# Altium schematic sheet ModuleAmp.SchDoc
size A; SheetNumber: 1; SheetTotal: 1
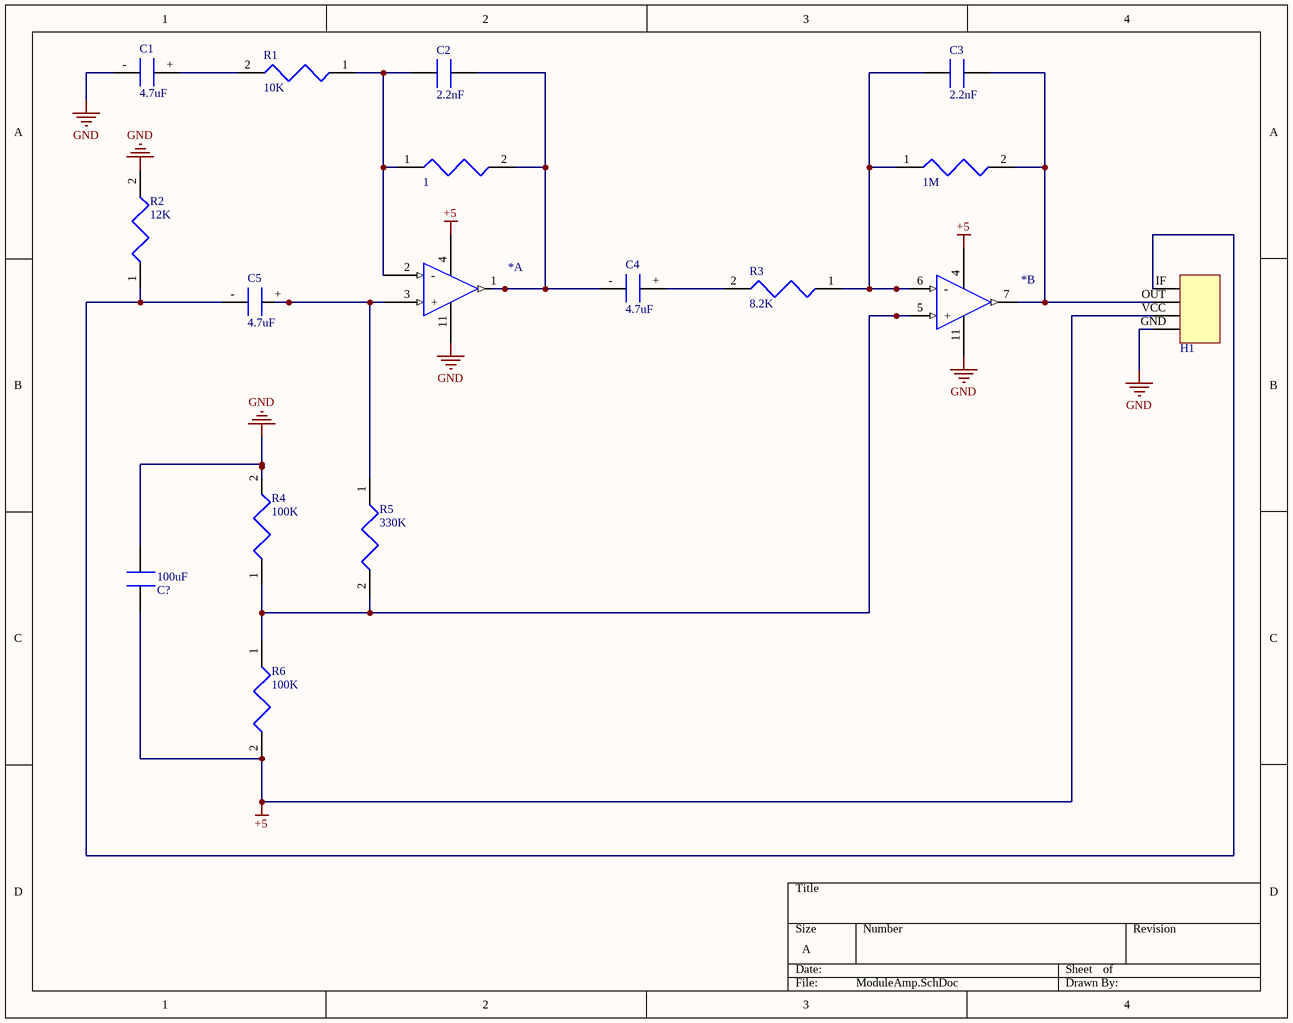
[diagram p0: ModuleAmp.SchDoc]

## Parts
(Parts that share a designator on the sheet are numbered #1, #2 ... from top to bottom, then left to right.)
1  R?  [R1M]  (value not drawn)
1M  R?  [R1M]  (value not drawn)
100uF  C?  [100uF]
*#1  LM324N  (value not drawn)  (part A of 4)
*#2  LM324N  (value not drawn)  (part B of 4)
C1  4.7uF  [4.7uF Polarised]
C2  2.2nF  [2.2nF]
C3  2.2nF  [2.2nF]
C4  4.7uF  [4.7uF Polarised]
C5  4.7uF  [4.7uF Polarised]
H1  Header  [4x1 Male]  (value not drawn)
R1  10K  [R10k]
R2  12K  [R12K]
R3  8.2K  [R8.2k]
R4  100K  [R100k]
R5  330K  [R330k]
R6  100K  [R100k]

## Nets
+5: 100uF.72 *#1.4(VCC) *#2.4(VCC) H1.VCC R6.2
GND: 100uF.71 *#1.11(GND) *#2.11(GND) C1.- H1.GND R2.2 R4.2
Net1_1: 1.1 *#1.2(-) C2.68 R1.1
Net1_2: 1.2 *#1.1(Out) C2.67 C4.-
Net1M_1: 1M.1 *#2.6(-) C3.70 R3.1
Net1M_2: 1M.2 *#2.7(Out) C3.69 H1.OUT
Net*#1_3: *#1.3(+) C5.+ R5.1
Net*#2_5: *#2.5(+) R4.1 R5.2 R6.1
NetC1_+: C1.+ R1.2
NetC4_+: C4.+ R3.2
NetC5_-: C5.- H1.IF R2.1

## Library data of the parts
1 1M = RNV14FAL1M00: Res Metal Film 1MegaOhm 1% 1/4W ±100ppm/°C Conformal Axial Box; Manufacturer: Stackpole Electronics; Resistance: 1MR; Max Power Dissipation: 250mW; Temperature Coefficient: 200ppm/°C; Supplier 1: Digikey; Supplier Part Number 1: RNV14FAL1M00CT-ND; Manufacturer Part Number: RNV14FAL1M00; RoHS: Yes; Category: Through-Hole Resistors; Stock 1: 115801; Pricing 1: 1=0.24, 10=0.19, 25=0.1456, 50=0.1054, 100=0.0742, 250=0.06, 500=0.04726, 1000=0.03272 (USD); Mount: Through Hole,Axial; Case/Package: Axial; Min Operating Temperature: -55°C; Max Operating Temperature: 155°C; Tolerance: 1%; Packaging: Cut Tape; Number of Terminations: 2; Features: Moisture Resistant,Flame Retardant Coating; Series: RNV; RoHS Compliant: Yes; ComponentLink1URL: https://www.seielect.com/Catalog/SEI-RNV.pdf?src-supplier=Digikey; ComponentLink1Description: https://www.seielect.com/Catalog/SEI-RNV.pdf?src-supplier=Digikey
100uF = ESK107M025AE3EA: Radial Can ALUMINUM ELECTROLYTIC CAPACITOR ESK 25V 100muF ±20% 0.248Dia 6.30mm; Manufacturer: KEMET; Supplier 1: Digikey; Supplier Part Number 1: 399-6650-1-ND; Manufacturer Part Number: ESK107M025AE3EA; RoHS: Yes; Category: Aluminum Electrolytic Capacitors; Stock 1: 196242; Pricing 1: 1=0.24, 10=0.157, 50=0.099, 100=0.0793, 500=0.05724, 1000=0.05064 (USD); ComponentLink1URL: https://datasheet.ciiva.com/5336/datasheetpn-esk107m025ae3ea-5336461.pdf?src-supplier=Mouser; ComponentLink1Description: https://datasheet.ciiva.com/5336/datasheetpn-esk107m025ae3ea-5336461.pdf?src-supplier=Mouser
*#1 *#2 = LM324N: Operational Amplifier, Quad, 1 Mhz, 4, 0.5 V/ S, 1.5V To 16V, Dip, 14 Rohs Compliant: Yes; Manufacturer: Texas Instruments; Supplier 1: Digikey; Supplier Part Number 1: 296-1391-5-ND; Manufacturer Part Number: LM324N; RoHS: No; Category: Amplifiers - Op Amps, Buffer, Instrumentation; Stock 1: 30137; Pricing 1: 1=0.44, 10=0.375, 25=0.35, 100=0.28, 250=0.25996, 500=0.21998, 1000=0.16998, 2500=0.15498, 5000=0.14499 (USD); ComponentLink1URL: https://datasheet.ciiva.com/5997/1768103-5997424.pdf?src-supplier=Farnell; ComponentLink1Description: https://datasheet.ciiva.com/5997/1768103-5997424.pdf?src-supplier=Farnell; ComponentLink2URL: https://datasheet.ciiva.com/1796/lm224-1796723.pdf?src-supplier=Digikey; ComponentLink2Description: https://datasheet.ciiva.com/1796/lm224-1796723.pdf?src-supplier=Digikey; ComponentLink3URL: https://datasheet.ciiva.com/7148/lm224-7148869.pdf?src-supplier=Newark; ComponentLink3Description: https://datasheet.ciiva.com/7148/lm224-7148869.pdf?src-supplier=Newark; ComponentLink4URL: https://datasheet.ciiva.com/8008/1905671-8008853.pdf?src-supplier=Element14; ComponentLink4Description: https://datasheet.ciiva.com/8008/1905671-8008853.pdf?src-supplier=Element14; ComponentLink5URL: https://datasheet.ciiva.com/7709/1840878-7709815.pdf?src-supplier=Element14; ComponentLink5Description: https://datasheet.ciiva.com/7709/1840878-7709815.pdf?src-supplier=Element14; ComponentLink6URL: https://datasheet.ciiva.com/7709/1840878-7709816.pdf?src-supplier=Element14; ComponentLink6Description: https://datasheet.ciiva.com/7709/1840878-7709816.pdf?src-supplier=Element14
C1 C4 C5 = ECA-2EM4R7B: Cap Aluminum 4.7uF 250V 20% (8 X 11.5mm) Radial 5mm 86mA 2000 hr 85°C Ammo Pack; Manufacturer: Panasonic; Supplier 1: Digikey; Supplier Part Number 1: 10-ECA-2EM4R7BCT-ND; Manufacturer Part Number: ECA-2EM4R7B; RoHS: Yes; Category: Aluminum Electrolytic Capacitors; Stock 1: 1000; Pricing 1: 1=0.47, 10=0.307, 50=0.2264, 100=0.1843, 500=0.14554 (USD); ComponentLink1URL: https://datasheet.ciiva.com/15198/getdatasheetpartid-481540-15198057.pdf?src-supplier=Verical; ComponentLink1Description: https://datasheet.ciiva.com/15198/getdatasheetpartid-481540-15198057.pdf?src-supplier=Verical
C2 = C731U222MZWDAA7317: Suppression Cap, 2200Pf, Class X1/ Y2 Rohs Compliant: Yes |Kemet C731U222MZWDAA7317; Manufacturer: KEMET; Supplier 1: Digikey; Supplier Part Number 1: 399-C731U222MZWDAA7317CT-ND; Manufacturer Part Number: C731U222MZWDAA7317; RoHS: Yes; Category: Ceramic Capacitors; Stock 1: 9860; Pricing 1: 1=0.43, 10=0.287, 50=0.2282, 100=0.1885, 500=0.14726 (USD); RoHS Compliant: Yes
C3 = C731U222MZWDAA7317_1: Suppression Cap, 2200Pf, Class X1/ Y2 Rohs Compliant: Yes |Kemet C731U222MZWDAA7317; Manufacturer: KEMET; Supplier 1: Digikey; Supplier Part Number 1: 399-C731U222MZWDAA7317CT-ND; Manufacturer Part Number: C731U222MZWDAA7317; RoHS: Yes; Category: Ceramic Capacitors; Stock 1: 9860; Pricing 1: 1=0.43, 10=0.287, 50=0.2282, 100=0.1885, 500=0.14726 (USD); RoHS Compliant: Yes
H1 = 22-23-2041: KK 254 Solid Header, Vertical, with Friction Lock, 4 Circuits, Tin (Sn) Plating; Manufacturer: Molex; Supplier 1: Digikey; Supplier Part Number 1: WM4202-ND; Manufacturer Part Number: 22-23-2041; RoHS: Yes; Category: Headers and Wire Housings; Stock 1: 35244; Pricing 1: 1=0.35, 10=0.281, 100=0.206, 1000=0.16385, 5000=0.14044, 10000=0.13108 (USD); ComponentLink1URL: https://datasheet.ciiva.com/5151/0022232041-pcb-headers-227043-5151795.pdf?src-supplier=Mouser; ComponentLink1Description: https://datasheet.ciiva.com/5151/0022232041-pcb-headers-227043-5151795.pdf?src-supplier=Mouser; ComponentLink2URL: https://datasheet.ciiva.com/11747/0900766b80d8f4d1-11747883.pdf?src-supplier=Rs; ComponentLink2Description: https://datasheet.ciiva.com/11747/0900766b80d8f4d1-11747883.pdf?src-supplier=Rs; ComponentLink3URL: https://datasheet.ciiva.com/19462/1966245-19462162.pdf?src-supplier=Jameco; ComponentLink3Description: https://datasheet.ciiva.com/19462/1966245-19462162.pdf?src-supplier=Jameco; ComponentLink4URL: https://datasheet.ciiva.com/19454/232282-19454309.pdf?src-supplier=Jameco; ComponentLink4Description: https://datasheet.ciiva.com/19454/232282-19454309.pdf?src-supplier=Jameco; ComponentLink5URL: https://datasheet.ciiva.com/7106/1859840-7106278.pdf?src-supplier=Newark; ComponentLink5Description: https://datasheet.ciiva.com/7106/1859840-7106278.pdf?src-supplier=Newark; ComponentLink6URL: https://datasheet.ciiva.com/7843/1896518-7843901.pdf?src-supplier=Element14; ComponentLink6Description: https://datasheet.ciiva.com/7843/1896518-7843901.pdf?src-supplier=Element14; ComponentLink7URL: https://datasheet.ciiva.com/16725/0022232041-pcb-headers-16725643.pdf?; ComponentLink7Description: https://datasheet.ciiva.com/16725/0022232041-pcb-headers-16725643.pdf?
R1 = CF14JT10K0: Res Carbon Film 10K Ohm 5% 0.25W(1/4W) -500ppm/ to 0pp|; Manufacturer: Stackpole Electronics; Supplier 1: Arrow Electronics; Supplier Part Number 1: CF14JT10K0; Manufacturer Part Number: CF14JT10K0; RoHS: Yes; Category: Through-Hole Resistors; Stock 1: 580000; Pricing 1: 5000=0.0073, 10000=0.0064 (USD); Lead Free: 5697LeadFree; ComponentLink1URL: http://components.arrow.com/part/dataview/27619991S9848636N1174?src-supplier=Arrow+Electronics; ComponentLink1Description: http://components.arrow.com/part/dataview/27619991S9848636N1174?src-supplier=Arrow+Electronics; ComponentLink2URL: https://www.seielect.com/catalog/SEI-Packaging.pdf?src-supplier=Digikey; ComponentLink2Description: https://www.seielect.com/catalog/SEI-Packaging.pdf?src-supplier=Digikey; ComponentLink3URL: https://www.verical.com/server-webapp/html/getDatasheet?partID=367360&src-supplier=Verical; ComponentLink3Description: https://www.verical.com/server-webapp/html/getDatasheet?partID=367360&src-supplier=Verical; ComponentLink4URL: https://www.seielect.com/catalog/SEI-CF_CFM.pdf?src-supplier=Avnet; ComponentLink4Description: https://www.seielect.com/catalog/SEI-CF_CFM.pdf?src-supplier=Avnet; ComponentLink5URL: http://www.seielect.com/Catalog/SEI-CF_CFM.pdf?src-supplier=Future+Electronics; ComponentLink5Description: http://www.seielect.com/Catalog/SEI-CF_CFM.pdf?src-supplier=Future+Electronics; ComponentLink6URL: https://datasheet.octopart.com/CF14JT10K0-Stackpole-Electronics-datasheet-8325406.pdf?src-supplier=Future+Electronics; ComponentLink6Description: https://datasheet.octopart.com/CF14JT10K0-Stackpole-Electronics-datasheet-8325406.pdf?src-supplier=Future+Electronics
R2 = RNMF14FTC12K0: Res Metal Film 12K Ohm 1% 1/4W ±50ppm/°C Conformal Axial Thru-Hole T/R; Manufacturer: Stackpole Electronics; Resistance: 12kR; Max Power Dissipation: 250mW; Supplier 1: Arrow Electronics; Supplier Part Number 1: RNMF14FTC12K0; Manufacturer Part Number: RNMF14FTC12K0; RoHS: Yes; Category: Through-Hole Resistors; Stock 1: 1810; Pricing 1: 1=0.041, 10=0.0205, 25=0.02, 100=0.0192, 250=0.0184, 500=0.0176, 1000=0.0168 (USD); Mount: Through Hole; Case/Package: Axial; Contact Plating: Tin,Matte; Min Operating Temperature: -55°C; Max Operating Temperature: 155°C; Tolerance: 1%; Package Quantity: 1; Packaging: Tape and Reel; Number of Terminations: 2; Temperature Coefficient: 50ppm/°C; Features: Flame Retardant Coating; Series: RNMF; Diameter: 2.35mm; Length: 0.13inch; Radiation Hardening: No; RoHS Compliant: Yes; ComponentLink1URL: http://www.seielect.com/Catalog/SEI-RNF_RNMF.pdf?src-supplier=Avnet; ComponentLink1Description: http://www.seielect.com/Catalog/SEI-RNF_RNMF.pdf?src-supplier=Avnet; ComponentLink2URL: https://www.seielect.com/catalog/SEI-Packaging.pdf?src-supplier=Digikey; ComponentLink2Description: https://www.seielect.com/catalog/SEI-Packaging.pdf?src-supplier=Digikey
R3 = PCF14JT8K20: Res Carbon Film 8.2K Ohm 5% 1/4W -400ppm/°C to 0ppm/°C Conformal AXL Thru-Hole T/R; Manufacturer: Stackpole Electronics; Supplier 1: Digikey; Supplier Part Number 1: 738-PCF14JT8K20CT-ND; Manufacturer Part Number: PCF14JT8K20; RoHS: Yes; Category: Through-Hole Resistors; Stock 1: 5384; Pricing 1: 1=0.12, 10=0.1, 25=0.0728, 50=0.0566, 100=0.0384, 250=0.03152, 500=0.02504, 1000=0.01778 (USD); ComponentLink1URL: http://www.seielect.com/Catalog/SEI-CF_CFM.pdf?src-supplier=Future+Electronics; ComponentLink1Description: http://www.seielect.com/Catalog/SEI-CF_CFM.pdf?src-supplier=Future+Electronics; ComponentLink2URL: https://www.seielect.com/catalog/sei-cf_cfm.pdf?src-supplier=Digikey; ComponentLink2Description: https://www.seielect.com/catalog/sei-cf_cfm.pdf?src-supplier=Digikey; ComponentLink3URL: https://www.seielect.com/catalog/SEI-CF_CFM.pdf?src-supplier=Avnet; ComponentLink3Description: https://www.seielect.com/catalog/SEI-CF_CFM.pdf?src-supplier=Avnet
R4 R6 = 1625892-8: Resistor, Metal Oxide, Res 100 Kilohms, Pwr-Rtg 3 W, Tol 5%, Axial | TE Connectivity ROX3SJ100K; Lead/Base Style: 4746ConnectorType; Number of Resistors: 1NUMBER; Voltage Rating: 350V; Supplier 1: Rs; Supplier Part Number 1: 1372756; Manufacturer: TE Connectivity; Manufacturer Part Number: 1625892-8; RoHS: Yes; Category: Through-Hole Resistors; Stock 1: 2000; Pricing 1: 50=0.232, 500=0.213, 1000=0.192, 2000=0.172, 4000=0.151 (GBP); Number of Pins: 2NUMBER; Voltage Rating (DC): 350V; Operating Supply Voltage: 350V; ELV: 5681ELVCompliant; Reach SVHC Compliant: 4186SVHC; ComponentLink1URL: https://datasheet.ciiva.com/6532/eng-ds-1773271-e-6532845.pdf?src-supplier=Digikey; ComponentLink1Description: https://datasheet.ciiva.com/6532/eng-ds-1773271-e-6532845.pdf?src-supplier=Digikey; ComponentLink2URL: https://datasheet.ciiva.com/45988/eng-ds-1773271-d-45988154.pdf?src-supplier=Onlinecomponents.com; ComponentLink2Description: https://datasheet.ciiva.com/45988/eng-ds-1773271-d-45988154.pdf?src-supplier=Onlinecomponents.com; ComponentLink3URL: https://datasheet.ciiva.com/17060/eng-ds-1773271-a-17060600.pdf?; ComponentLink3Description: https://datasheet.ciiva.com/17060/eng-ds-1773271-a-17060600.pdf?
R5 = RN65D3303FB14: Metal Film Resistors - Through Hole 1/2watt 330Kohms 1% 100ppm; Manufacturer: Vishay Dale; Resistance: 330kR; Power Rating: 500mW; Voltage Rating: 350V; Temperature Coefficient: 100ppm/°C; Lead Diameter: 0.64mm; Supplier 1: Mouser; Supplier Part Number 1: 71-RN65D-F-330K; Manufacturer Part Number: RN65D3303FB14; RoHS: No; Category: Through-Hole Resistors; Stock 1: 509; Pricing 1: 1=0.53, 10=0.429, 50=0.429, 100=0.429, 1000=0.429, 10000=0.272 (USD); Mount: Through Hole; Case/Package: Axial; Min Operating Temperature: -65°C; Max Operating Temperature: 175°C; Tolerance: 1%; Packaging: Bulk; Package Quantity: 100; Termination: Axial; Number of Terminations: 2; Max Power Dissipation: 500mW; Features: Moisture Resistant,Military,Flame Retardant Coating; Series: Military, MIL-R-10509/2, RN65; Length: 0.562inch; Width: 4.57mm; Lead Free: Contains Lead; RoHS Compliant: No; ComponentLink1URL: https://datasheet.ciiva.com/13963/cmfmil-13963855.pdf?src-supplier=Digikey; ComponentLink1Description: https://datasheet.ciiva.com/13963/cmfmil-13963855.pdf?src-supplier=Digikey